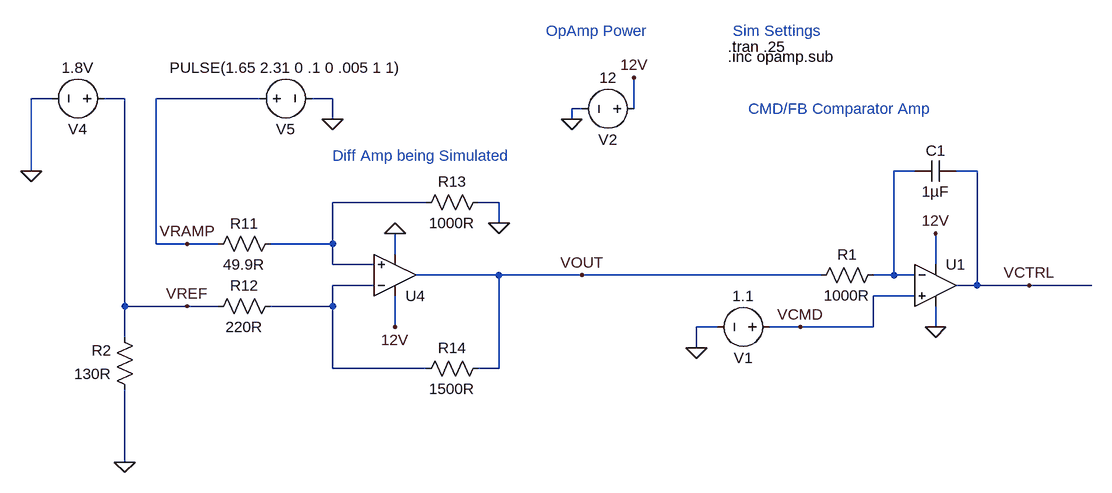
[diagram p0: schematic Diff_Amp_2_Ramp_Test.asc]
Diff_Amp_2_Ramp_Test.asc, the LTspice schematic file:
Version 4
SHEET 1 880 2032
WIRE -1296 1312 -1328 1312
WIRE -1184 1312 -1216 1312
WIRE -976 1312 -1136 1312
WIRE -864 1312 -896 1312
WIRE -480 1328 -496 1328
WIRE -400 1328 -400 1280
WIRE -864 1344 -864 1312
WIRE -496 1344 -496 1328
WIRE -1328 1424 -1328 1312
WIRE 32 1424 0 1424
WIRE 128 1424 96 1424
WIRE -720 1472 -864 1472
WIRE -608 1472 -640 1472
WIRE -608 1504 -608 1472
WIRE -1136 1536 -1136 1312
WIRE -1088 1536 -1136 1536
WIRE -1040 1536 -1088 1536
WIRE -864 1536 -864 1472
WIRE -864 1536 -960 1536
WIRE -768 1552 -768 1520
WIRE -864 1568 -864 1536
WIRE -800 1568 -864 1568
WIRE 64 1568 64 1520
WIRE -608 1584 -736 1584
WIRE -480 1584 -608 1584
WIRE -112 1584 -480 1584
WIRE 0 1584 0 1424
WIRE 0 1584 -32 1584
WIRE 32 1584 0 1584
WIRE -800 1600 -864 1600
WIRE 128 1600 128 1424
WIRE 128 1600 96 1600
WIRE 208 1600 128 1600
WIRE 304 1600 208 1600
WIRE 32 1616 -32 1616
WIRE -1184 1632 -1184 1312
WIRE -1088 1632 -1184 1632
WIRE -1040 1632 -1088 1632
WIRE -864 1632 -864 1600
WIRE -864 1632 -960 1632
WIRE -768 1664 -768 1616
WIRE -272 1664 -304 1664
WIRE -144 1664 -192 1664
WIRE -32 1664 -32 1616
WIRE -32 1664 -144 1664
WIRE 64 1664 64 1632
WIRE -1184 1680 -1184 1632
WIRE -304 1696 -304 1664
WIRE -864 1728 -864 1632
WIRE -720 1728 -864 1728
WIRE -608 1728 -608 1584
WIRE -608 1728 -640 1728
WIRE -1184 1872 -1184 1760
FLAG -496 1344 0
FLAG -400 1280 12V
FLAG -768 1664 12V
FLAG -768 1520 0
FLAG -1184 1872 0
FLAG -1328 1424 0
FLAG -608 1504 0
FLAG -864 1344 0
FLAG -1088 1632 VREF
FLAG -480 1584 VOUT
FLAG -1088 1536 VRAMP
FLAG 64 1520 12V
FLAG 64 1664 0
FLAG 208 1600 VCTRL
FLAG -144 1664 VCMD
FLAG -304 1696 0
SYMBOL voltage -384 1328 R90
WINDOW 0 32 56 VTop 2
WINDOW 3 -32 56 VBottom 2
WINDOW 123 0 0 Left 0
WINDOW 39 0 0 Left 0
SYMATTR InstName V2
SYMATTR Value 12
SYMBOL OpAmps\\UniversalOpamp2 -768 1584 M180
SYMATTR InstName U4
SYMBOL res -944 1520 R90
WINDOW 0 0 56 VBottom 2
WINDOW 3 32 56 VTop 2
SYMATTR InstName R11
SYMATTR Value 49.9R
SYMBOL res -944 1616 R90
WINDOW 0 0 56 VBottom 2
WINDOW 3 32 56 VTop 2
SYMATTR InstName R12
SYMATTR Value 220R
SYMATTR SpiceLine tol=1
SYMBOL res -624 1456 R90
WINDOW 0 0 56 VBottom 2
WINDOW 3 32 56 VTop 2
SYMATTR InstName R13
SYMATTR Value 1000R
SYMBOL res -624 1712 R90
WINDOW 0 0 56 VBottom 2
WINDOW 3 32 56 VTop 2
SYMATTR InstName R14
SYMATTR Value 1500R
SYMATTR SpiceLine tol=1
SYMBOL voltage -1200 1312 R90
WINDOW 0 32 56 VTop 2
WINDOW 3 -32 56 VBottom 2
WINDOW 123 0 0 Left 0
WINDOW 39 0 0 Left 0
SYMATTR InstName V4
SYMATTR Value 1.8V
SYMBOL voltage -992 1312 M90
WINDOW 0 32 56 VTop 2
WINDOW 3 -32 56 VBottom 2
WINDOW 123 0 0 Left 0
WINDOW 39 0 0 Left 0
SYMATTR InstName V5
SYMATTR Value PULSE(1.65 2.31 0 .1 0 .005 1 1)
SYMBOL OpAmps\\UniversalOpamp2 64 1600 R0
SYMATTR InstName U1
SYMBOL res -16 1568 R90
WINDOW 0 0 56 VBottom 2
WINDOW 3 32 56 VTop 2
SYMATTR InstName R1
SYMATTR Value 1000R
SYMBOL voltage -176 1664 R90
WINDOW 0 32 56 VTop 2
WINDOW 3 -32 56 VBottom 2
WINDOW 123 0 0 Left 0
WINDOW 39 0 0 Left 0
SYMATTR InstName V1
SYMATTR Value 1.1
SYMBOL cap 96 1408 R90
WINDOW 0 0 32 VBottom 2
WINDOW 3 32 32 VTop 2
SYMATTR InstName C1
SYMATTR Value 1µF
SYMBOL res -1168 1776 R180
WINDOW 0 36 76 Left 2
WINDOW 3 36 40 Left 2
SYMATTR InstName R2
SYMATTR Value 130R
TEXT -256 1232 Left 2 !.tran .25
TEXT -256 1248 Left 2 !.inc opamp.sub
TEXT -536 1208 Left 2 ;OpAmp Power
TEXT -248 1208 Left 2 ;Sim Settings
TEXT -224 1328 Left 2 ;CMD/FB Comparator Amp
TEXT -864 1400 Left 2 ;Diff Amp being Simulated

The netlist it stands for:
* Diff_Amp_2_Ramp_Test.asc
V2 12V 0 12
XU4 N002 N003 12V 0 VOUT level.2 Avol=1Meg GBW=10Meg Slew=10Meg ilimit=25m rail=0 Vos=0 phimargin=45 en=0 enk=0 in=0 ink=0 Rin=500Meg  ; pins IN+ IN- V+ V- OUT
R11 N002 VRAMP 49.9R
R12 N003 VREF 220R tol=1
R13 0 N002 1000R
R14 VOUT N003 1500R tol=1
V4 VREF 0 1.8V
V5 VRAMP 0 PULSE(1.65 2.31 0 .1 0 .005 1 1)
XU1 VCMD N001 12V 0 VCTRL level.2 Avol=1Meg GBW=10Meg Slew=10Meg ilimit=25m rail=0 Vos=0 phimargin=45 en=0 enk=0 in=0 ink=0 Rin=500Meg  ; pins IN+ IN- V+ V- OUT
R1 N001 VOUT 1000R
V1 VCMD 0 1.1
C1 VCTRL N001 1µF
R2 0 VREF 130R
.tran .25
.inc opamp.sub
* OpAmp Power
* Sim Settings
* CMD/FB Comparator Amp
* Diff Amp being Simulated
.lib UniversalOpamps2.sub
.backanno
.end